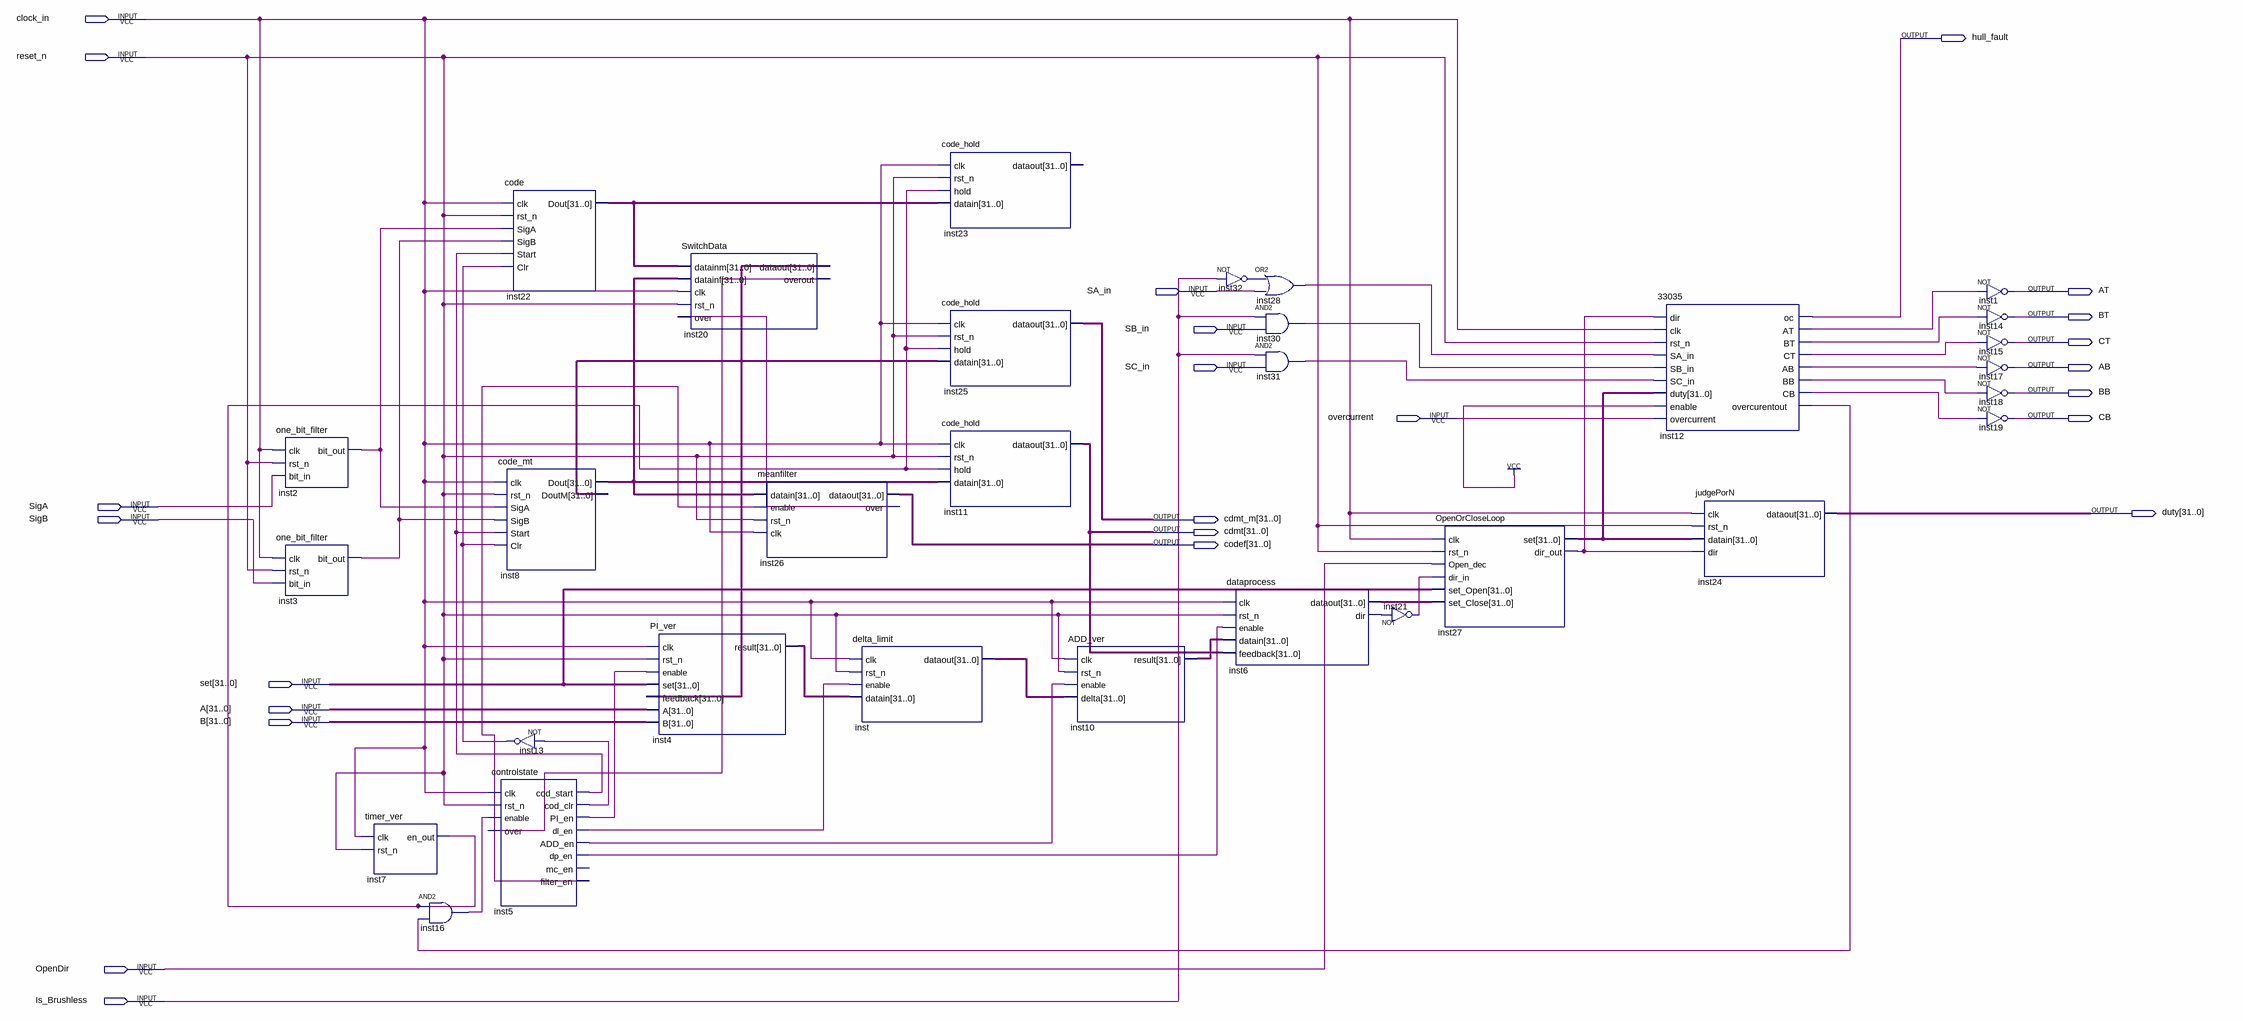
[diagram p0: schematic sheet]
// Quartus schematic motorcontrol.bdf as structural Verilog: 31 symbols, 24 pins
module motorcontrol (
  input  clock_in,
  input  reset_n,
  input  SA_in,
  input  SB_in,
  input  SC_in,
  input  overcurrent,
  input  SigA,
  input  SigB,
  input  [31:0] set,
  input  [31:0] A,
  input  [31:0] B,
  input  OpenDir,
  input  Is_Brushless,
  output hull_fault,
  output AT,
  output BT,
  output CT,
  output AB,
  output BB,
  output CB,
  output [31:0] duty,
  output [31:0] cdmt_m,
  output [31:0] cdmt,
  output [31:0] codef
);

  wire inst2_bit_out, inst3_bit_out, inst5_add_en, inst5_cod_clr, inst5_cod_start, inst5_dl_en, inst5_dp_en,
       inst5_filter_en, inst5_pi_en, inst6_dir, inst7_en_out, inst12_ab, inst12_at, inst12_bb, inst12_bt,
       inst12_cb, inst12_ct, inst12_overcurentout, inst13_out, inst16_out, inst20_overout, inst21_out,
       inst26_over, inst27_dir_out, inst28_out, inst30_out, inst31_out, inst32_out;
  wire [31:0] inst4_result, inst6_dataout, inst8_dout, inst8_doutm, inst10_result, inst20_dataout,
       inst22_dout, inst27_set, inst_dataout;

  one_bit_filter inst2 (.clk(clock_in), .rst_n(reset_n), .bit_in(SigA), .bit_out(inst2_bit_out));
  one_bit_filter inst3 (.clk(clock_in), .rst_n(reset_n), .bit_in(SigB), .bit_out(inst3_bit_out));
  timer_ver inst7 (.clk(clock_in), .rst_n(reset_n), .en_out(inst7_en_out));
  and inst16 (inst16_out, inst7_en_out, inst12_overcurentout);
  code inst22 (
    .clk(clock_in), .rst_n(reset_n), .SigA(inst2_bit_out), .SigB(inst3_bit_out), .Start(inst5_cod_start),
    .Clr(inst13_out), .Dout(inst22_dout));
  code_mt inst8 (
    .clk(clock_in), .rst_n(reset_n), .SigA(inst2_bit_out), .SigB(inst3_bit_out), .Start(inst5_cod_start),
    .Clr(inst13_out), .Dout(inst8_dout), .DoutM(inst8_doutm));
  not inst13 (inst13_out, inst5_cod_clr);
  controlstate inst5 (
    .clk(clock_in), .rst_n(reset_n), .enable(inst16_out), .over(inst20_overout), .cod_start(inst5_cod_start),
    .cod_clr(inst5_cod_clr), .PI_en(inst5_pi_en), .dl_en(inst5_dl_en), .ADD_en(inst5_add_en),
    .dp_en(inst5_dp_en), .filter_en(inst5_filter_en));  // open: mc_en
  SwitchData inst20 (
    .datainm(inst22_dout), .datainf(inst8_dout), .clk(clock_in), .rst_n(reset_n), .over(inst26_over),
    .dataout(inst20_dataout), .overout(inst20_overout));
  PI_ver inst4 (
    .clk(clock_in), .rst_n(reset_n), .enable(inst5_pi_en), .set(set), .feedback(inst20_dataout), .A(A),
    .B(B), .result(inst4_result));
  meanfilter inst26 (
    .datain(inst8_dout), .enable(inst5_filter_en), .rst_n(reset_n), .clk(clock_in), .dataout(codef),
    .over(inst26_over));
  delta_limit inst (
    .clk(clock_in), .rst_n(reset_n), .enable(inst5_dl_en), .datain(inst4_result), .dataout(inst_dataout));
  code_hold inst23 (.clk(clock_in), .rst_n(reset_n), .hold(inst7_en_out), .datain(inst22_dout));  // open: dataout
  code_hold inst25 (.clk(clock_in), .rst_n(reset_n), .hold(inst7_en_out), .datain(inst8_doutm), .dataout(cdmt_m));
  code_hold inst11 (.clk(clock_in), .rst_n(reset_n), .hold(inst7_en_out), .datain(inst8_dout), .dataout(cdmt));
  ADD_ver inst10 (.clk(clock_in), .rst_n(reset_n), .enable(inst5_add_en), .delta(inst_dataout), .result(inst10_result));
  not inst32 (inst32_out, Is_Brushless);
  dataprocess inst6 (
    .clk(clock_in), .rst_n(reset_n), .enable(inst5_dp_en), .datain(inst10_result), .feedback(cdmt),
    .dataout(inst6_dataout), .dir(inst6_dir));
  or inst28 (inst28_out, inst32_out, SA_in);
  and inst30 (inst30_out, Is_Brushless, SB_in);
  and inst31 (inst31_out, Is_Brushless, SC_in);
  not inst21 (inst21_out, inst6_dir);
  OpenOrCloseLoop inst27 (
    .clk(clock_in), .rst_n(reset_n), .Open_dec(OpenDir), .dir_in(inst21_out), .set_Open(set),
    .set_Close(inst6_dataout), .set(inst27_set), .dir_out(inst27_dir_out));
  \33035  inst12 (
    .dir(inst27_dir_out), .clk(clock_in), .rst_n(reset_n), .SA_in(inst28_out), .SB_in(inst30_out),
    .SC_in(inst31_out), .duty(inst27_set), .enable(1'b1), .overcurrent(overcurrent), .oc(hull_fault),
    .AT(inst12_at), .BT(inst12_bt), .CT(inst12_ct), .AB(inst12_ab), .BB(inst12_bb), .CB(inst12_cb),
    .overcurentout(inst12_overcurentout));
  judgePorN inst24 (.clk(clock_in), .rst_n(reset_n), .datain(inst27_set), .dir(inst27_dir_out), .dataout(duty));
  not inst1 (AT, inst12_at);
  not inst14 (BT, inst12_bt);
  not inst15 (CT, inst12_ct);
  not inst17 (AB, inst12_ab);
  not inst18 (BB, inst12_bb);
  not inst19 (CB, inst12_cb);
endmodule
